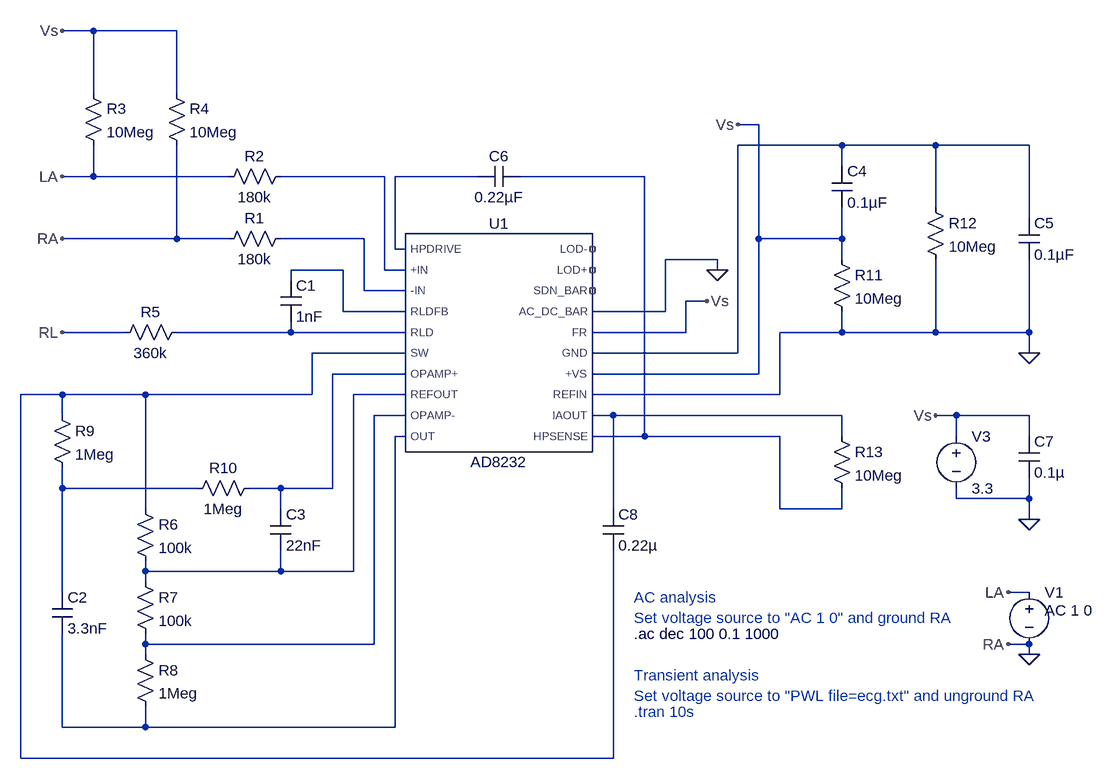
[diagram p0: schematic ecg_sim_2.asc]
ecg_sim_2.asc, the LTspice schematic file:
Version 4
SHEET 1 1824 924
WIRE -400 -352 -448 -352
WIRE -272 -352 -400 -352
WIRE -400 -256 -400 -352
WIRE -272 -256 -272 -352
WIRE 624 -208 592 -208
WIRE 752 -176 592 -176
WIRE 896 -176 752 -176
WIRE 1040 -176 896 -176
WIRE 752 -144 752 -176
WIRE -400 -128 -400 -176
WIRE -400 -128 -448 -128
WIRE -192 -128 -400 -128
WIRE 48 -128 -112 -128
WIRE 192 -128 64 -128
WIRE 448 -128 256 -128
WIRE 896 -80 896 -176
WIRE 1040 -64 1040 -176
WIRE -272 -32 -272 -176
WIRE -272 -32 -448 -32
WIRE -192 -32 -272 -32
WIRE 16 -32 -112 -32
WIRE 624 -32 624 -208
WIRE 752 -32 752 -80
WIRE 752 -32 624 -32
WIRE 64 -16 64 -128
WIRE 80 -16 64 -16
WIRE 560 0 480 0
WIRE 752 0 752 -32
WIRE -16 16 -96 16
WIRE 48 16 48 -128
WIRE 80 16 48 16
WIRE 560 16 560 0
WIRE -96 32 -96 16
WIRE 16 48 16 -32
WIRE 80 48 16 48
WIRE 544 64 512 64
WIRE -16 80 -16 16
WIRE 80 80 -16 80
WIRE 480 80 480 0
WIRE 480 80 368 80
WIRE -352 112 -448 112
WIRE -96 112 -96 96
WIRE -96 112 -272 112
WIRE 80 112 -96 112
WIRE 512 112 512 64
WIRE 512 112 368 112
WIRE 752 112 752 80
WIRE 752 112 656 112
WIRE 896 112 896 0
WIRE 896 112 752 112
WIRE 1040 112 1040 0
WIRE 1040 112 896 112
WIRE 80 144 -64 144
WIRE 592 144 592 -176
WIRE 592 144 368 144
WIRE 1040 144 1040 112
WIRE 80 176 -32 176
WIRE 624 176 624 -32
WIRE 624 176 368 176
WIRE -448 208 -512 208
WIRE -320 208 -448 208
WIRE -64 208 -64 144
WIRE -64 208 -320 208
WIRE 80 208 0 208
WIRE 656 208 656 112
WIRE 656 208 368 208
WIRE -448 240 -448 208
WIRE 80 240 32 240
WIRE 400 240 368 240
WIRE 752 240 400 240
WIRE 928 240 896 240
WIRE 1040 240 928 240
WIRE 80 272 64 272
WIRE 448 272 448 -128
WIRE 448 272 368 272
WIRE 656 272 448 272
WIRE 752 272 752 240
WIRE 928 272 928 240
WIRE 1040 272 1040 240
WIRE -448 352 -448 320
WIRE -240 352 -448 352
WIRE -112 352 -160 352
WIRE -32 352 -32 176
WIRE -32 352 -112 352
WIRE 928 368 928 352
WIRE 1040 368 1040 336
WIRE 1040 368 928 368
WIRE -320 384 -320 208
WIRE -112 384 -112 352
WIRE 400 384 400 240
WIRE 656 384 656 272
WIRE 752 384 752 352
WIRE 752 384 656 384
WIRE 1040 400 1040 368
WIRE -320 480 -320 464
WIRE -112 480 -112 448
WIRE -112 480 -320 480
WIRE 0 480 0 208
WIRE 0 480 -112 480
WIRE -320 496 -320 480
WIRE -448 512 -448 352
WIRE 1040 512 1008 512
WIRE -320 592 -320 576
WIRE 32 592 32 240
WIRE 32 592 -320 592
WIRE 1040 592 1008 592
WIRE -320 608 -320 592
WIRE 1040 608 1040 592
WIRE -448 720 -448 576
WIRE -320 720 -320 688
WIRE -320 720 -448 720
WIRE 64 720 64 272
WIRE 64 720 -320 720
WIRE -512 768 -512 208
WIRE 400 768 400 448
WIRE 400 768 -512 768
FLAG 1008 512 LA
FLAG 1008 592 RA
FLAG -448 -352 Vs
FLAG -448 -128 LA
FLAG -448 -32 RA
FLAG -448 112 RL
FLAG 544 64 Vs
FLAG 560 16 0
FLAG 1040 144 0
FLAG 896 240 Vs
FLAG 1040 400 0
FLAG 592 -208 Vs
FLAG 1040 608 0
SYMBOL AD8232 224 128 R0
SYMATTR InstName U1
SYMBOL voltage 1040 496 R0
WINDOW 123 24 44 Left 2
WINDOW 39 0 0 Left 0
WINDOW 3 24 44 Left 2
SYMATTR Value2 AC 1 0
SYMATTR Value ""
SYMATTR InstName V1
SYMBOL res -96 -48 R90
WINDOW 0 0 56 VBottom 2
WINDOW 3 32 56 VTop 2
SYMATTR InstName R1
SYMATTR Value 180k
SYMBOL res -96 -144 R90
WINDOW 0 0 56 VBottom 2
WINDOW 3 32 56 VTop 2
SYMATTR InstName R2
SYMATTR Value 180k
SYMBOL res -416 -272 R0
SYMATTR InstName R3
SYMATTR Value 10Meg
SYMBOL res -288 -272 R0
SYMATTR InstName R4
SYMATTR Value 10Meg
SYMBOL cap -112 32 R0
SYMATTR InstName C1
SYMATTR Value 1nF
SYMBOL res -256 96 R90
WINDOW 0 0 56 VBottom 2
WINDOW 3 32 56 VTop 2
SYMATTR InstName R5
SYMATTR Value 360k
SYMBOL res -336 368 R0
SYMATTR InstName R6
SYMATTR Value 100k
SYMBOL res -336 480 R0
SYMATTR InstName R7
SYMATTR Value 100k
SYMBOL res -336 592 R0
SYMATTR InstName R8
SYMATTR Value 1Meg
SYMBOL cap -464 512 R0
SYMATTR InstName C2
SYMATTR Value 3.3nF
SYMBOL cap -128 384 R0
SYMATTR InstName C3
SYMATTR Value 22nF
SYMBOL res -464 224 R0
SYMATTR InstName R9
SYMATTR Value 1Meg
SYMBOL res -144 336 R90
WINDOW 0 0 56 VBottom 2
WINDOW 3 32 56 VTop 2
SYMATTR InstName R10
SYMATTR Value 1Meg
SYMBOL res 736 -16 R0
SYMATTR InstName R11
SYMATTR Value 10Meg
SYMBOL cap 736 -144 R0
SYMATTR InstName C4
SYMATTR Value 0.1µF
SYMBOL res 880 -96 R0
SYMATTR InstName R12
SYMATTR Value 10Meg
SYMBOL cap 1024 -64 R0
SYMATTR InstName C5
SYMATTR Value 0.1µF
SYMBOL res 736 256 R0
SYMATTR InstName R13
SYMATTR Value 10Meg
SYMBOL cap 256 -144 R90
WINDOW 0 0 32 VBottom 2
WINDOW 3 32 32 VTop 2
SYMATTR InstName C6
SYMATTR Value 0.22µF
SYMBOL voltage 928 256 R0
SYMATTR InstName V3
SYMATTR Value 3.3
SYMBOL cap 1024 272 R0
SYMATTR InstName C7
SYMATTR Value 0.1µ
SYMBOL cap 384 384 R0
SYMATTR InstName C8
SYMATTR Value 0.22µ
TEXT 432 640 Left 2 ;Transient analysis\nSet voltage source to "PWL file=ecg.txt" and unground RA
TEXT 432 696 Left 2 ;.tran 10s
TEXT 432 576 Left 2 !.ac dec 100 0.1 1000
TEXT 432 520 Left 2 ;AC analysis\nSet voltage source to "AC 1 0" and ground RA

The netlist it stands for:
* ecg_sim_2.asc
XU1 N003 N002 N005 N006 N007 N008 N009 N010 N011 N013 NC_01 NC_02 NC_03 0 Vs N001 Vs 0 N012 N004 AD8232  ; pins HPDRIVE +IN -IN RLDFB RLD SW OPAMP+ REFOUT OPAMP- OUT LOD- LOD+ SDN_BAR AC_DC_BAR FR GND +VS REFIN IAOUT HPSENSE
V1 LA 0 AC 1 0
R1 N005 0 180k
R2 N002 LA 180k
R3 Vs LA 10Meg
R4 Vs 0 10Meg
C1 N006 N007 1nF
R5 N007 RL 360k
R6 N008 N010 100k
R7 N010 N011 100k
R8 N011 N013 1Meg
C2 N014 N013 3.3nF
C3 N009 N010 22nF
R9 N008 N014 1Meg
R10 N009 N014 1Meg
R11 Vs 0 10Meg
C4 N001 Vs 0.1µF
R12 N001 0 10Meg
C5 N001 0 0.1µF
R13 N012 N004 10Meg
C6 N004 N003 0.22µF
V3 Vs 0 3.3
C7 Vs 0 0.1µ
C8 N012 N008 0.22µ
* Transient analysis
* Set voltage source to "PWL file=ecg.txt" and unground RA
* .tran 10s
.ac dec 100 0.1 1000
* AC analysis
* Set voltage source to "AC 1 0" and ground RA
.lib /Users/Steve/Repositories/ec-stingy/AD8232.cir
.backanno
.end